# EasyEDA schematic G1000_Nav_Switch.json
TITLE: Sheet_1; REV: 1.0; Date: 2024-03-31; Sheet: 1/1; Drawn By: gagagu1; Company: Your Company
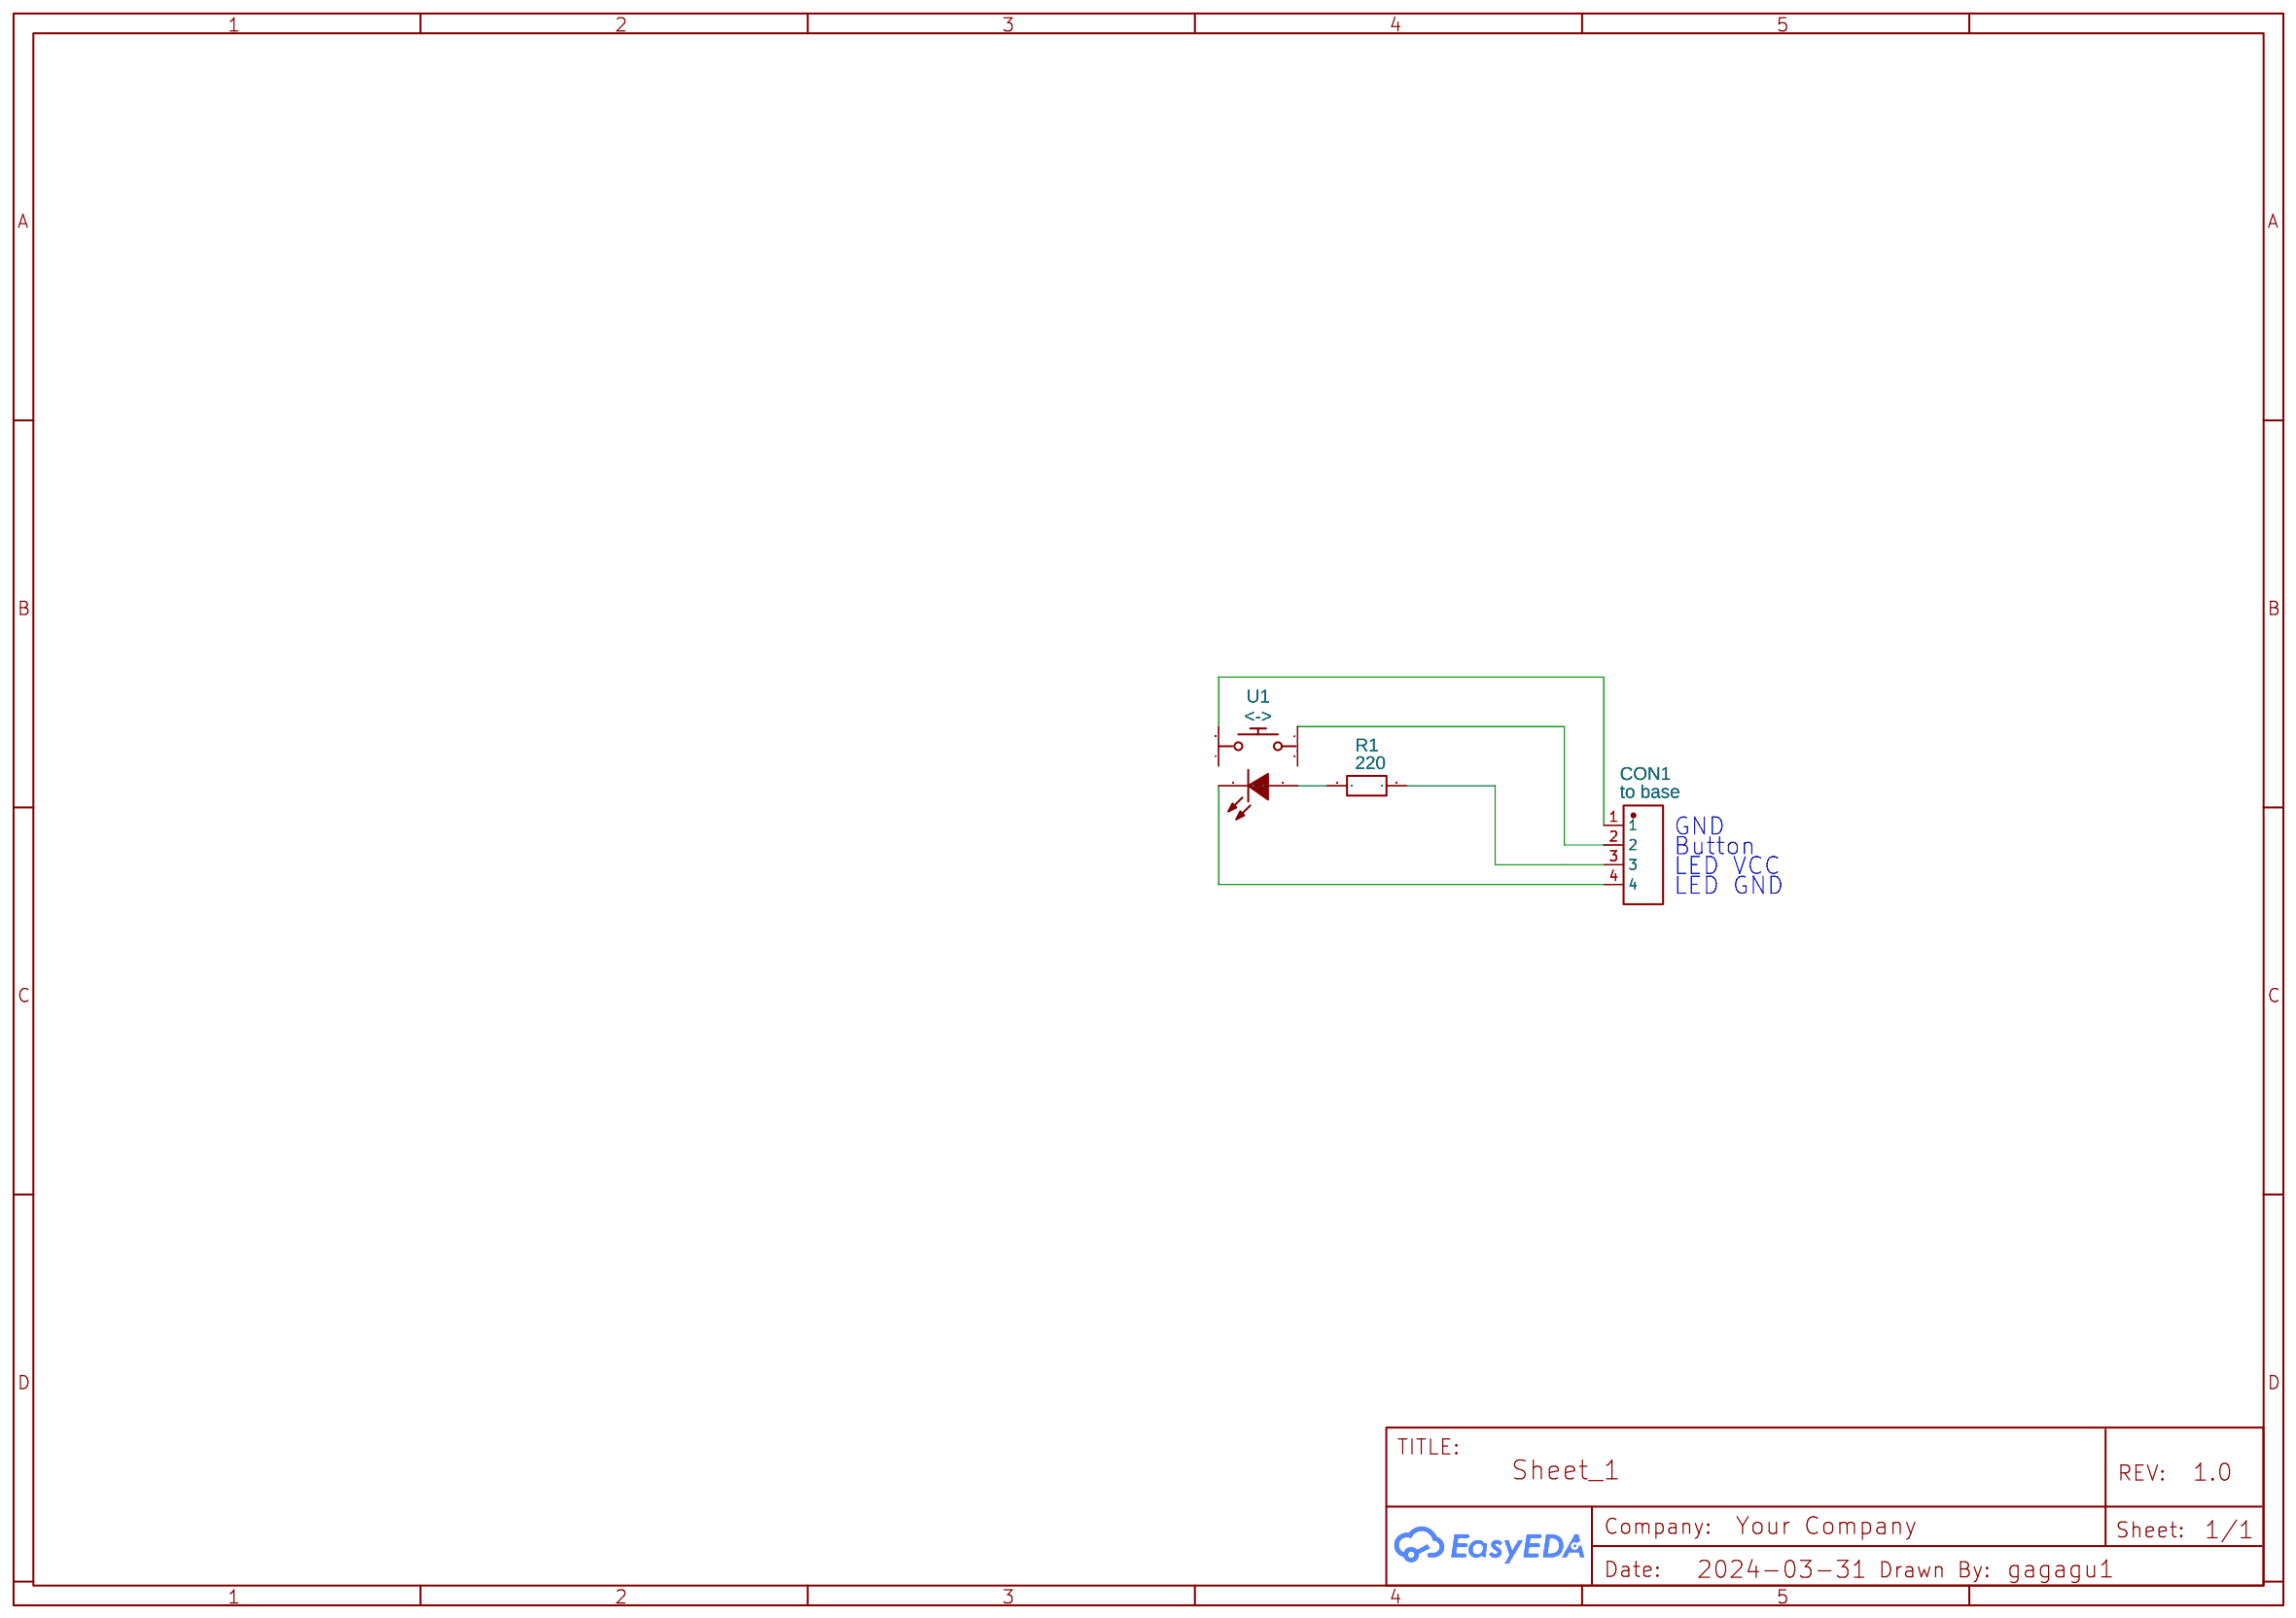
[diagram p0: schematic sheet]

## Parts
CON1  to base  [1X4 PIN]
R1  220  [R_AXIAL-0.4]
U1  <->  [6X6_LED+PUSHBUTTON]

## Library data of the parts
CON1 = 1X4PIN: Supplier: LCSC; Supplier Part: C225501; Manufacturer: Changjiang Connectors; Manufacturer Part: A2541HWV-4P; Contributor: LCSC; JLCPCB Part Class: Extended Part
R1 = R_AXIAL-0.4_EU: Contributor: LCEDA_Lib
U1 = 6X6_LED+PUSHBUTTON V2: sourceId: 5viSsqoYV; Contributor: Aleix Ferrero

## Nets
Net-(CON1-1): CON1.1 U1.3
Net-(CON1-2): CON1.2 U1.1
Net-(CON1-3): CON1.3 R1.1
Net-(CON1-4): CON1.4 U1.C
Net-(R1-2): R1.2 U1.A

Not connected (* = marked no-connect by the designer): U1 2 4

## Notes on the sheet
- GND
- Button
- LED VCC
- LED GND
